# Altium schematic sheet ad2_1.schdoc
size A2
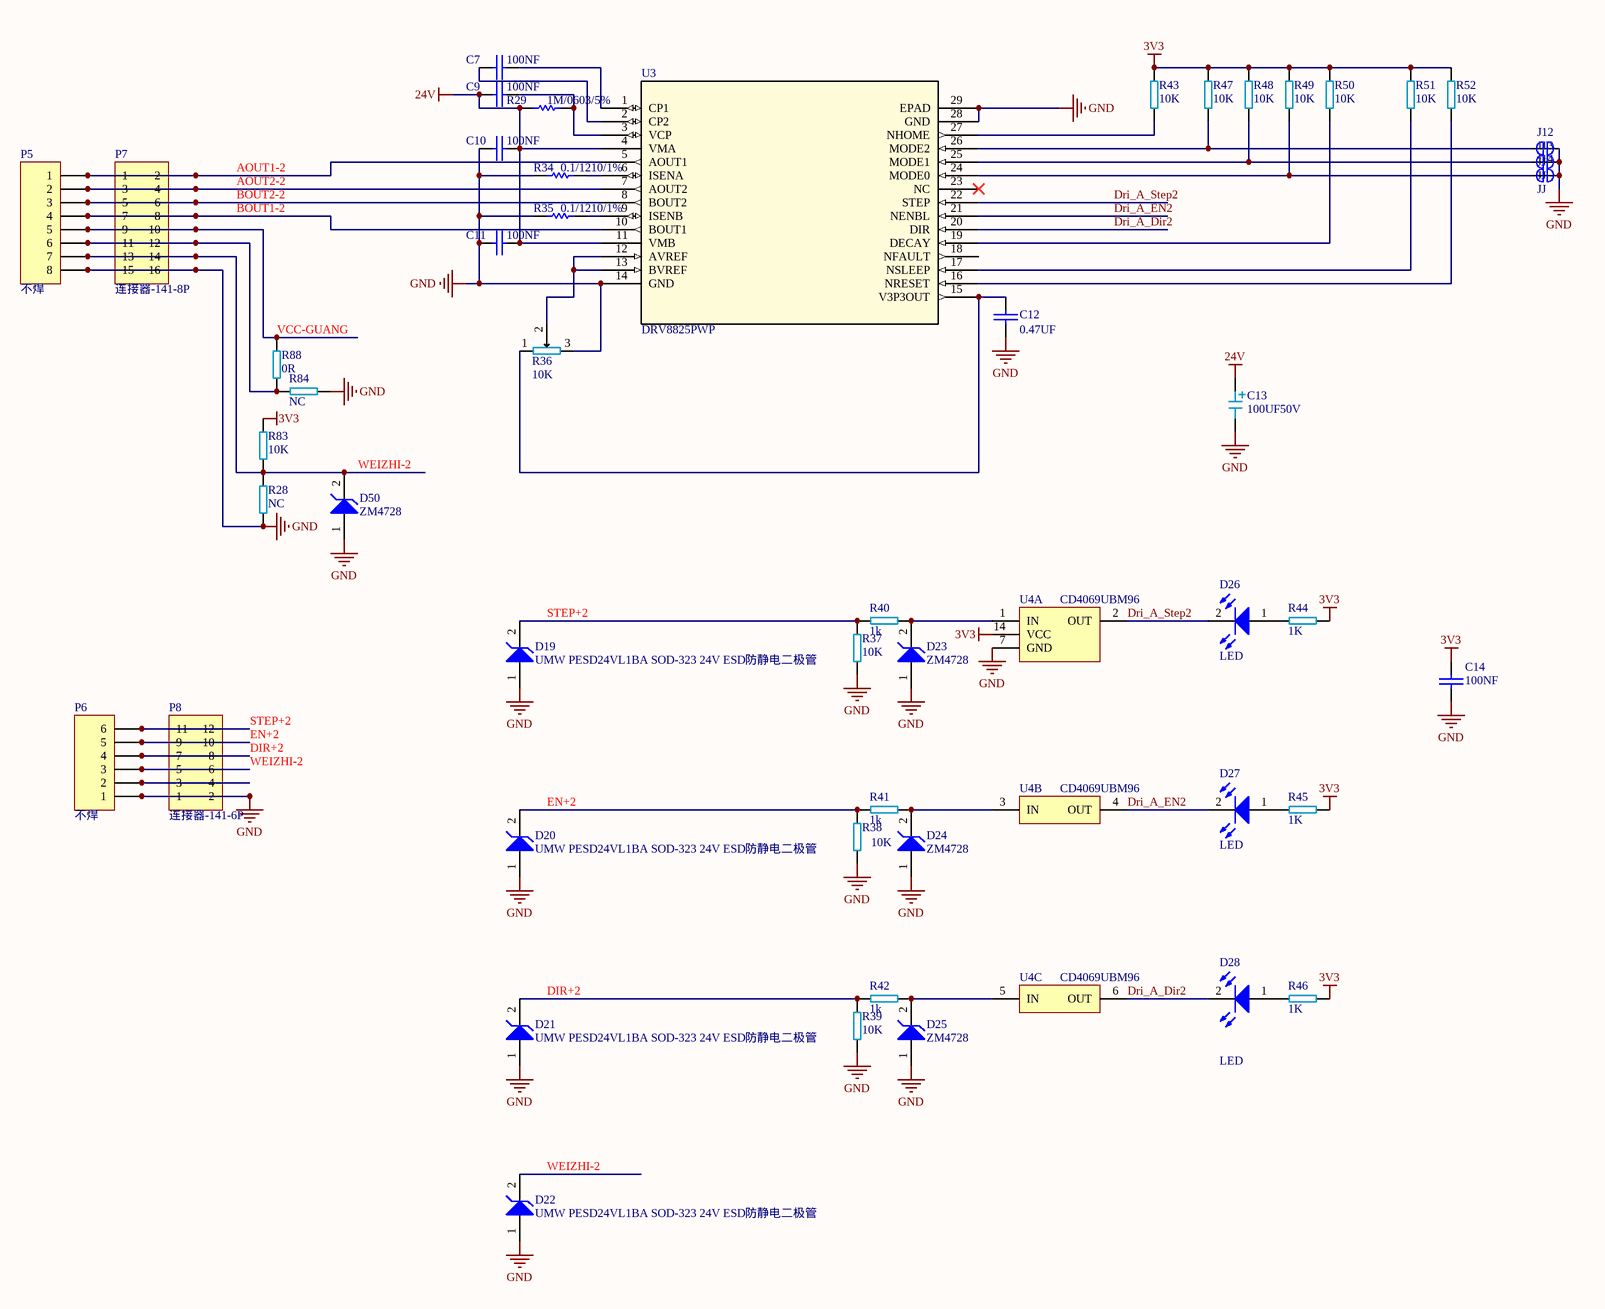
[diagram p0: ad2_1.schdoc]

## Parts
C7  100NF  [C0603]
C9  100NF  [C0603]
C10  100NF  [C0603]
C11  100NF  [C0603]
C12  0.47UF  [C0603]
C13  100UF50V  [CE8]
C14  100NF  [C0603]
D19  UMW PESD24VL1BA SOD-323 24V ESD防静电二极管  [SOD323]
D20  UMW PESD24VL1BA SOD-323 24V ESD防静电二极管  [SOD323]
D21  UMW PESD24VL1BA SOD-323 24V ESD防静电二极管  [SOD323]
D22  UMW PESD24VL1BA SOD-323 24V ESD防静电二极管  [SOD323]
D23  ZM4728  [D1206]
D24  ZM4728  [D1206]
D25  ZM4728  [D1206]
D26  LED  [LED0603]
D27  LED  [LED0603]
D28  LED  [LED0603]
D50  ZM4728  [D1206]
J12  JJ  [TIAOXIAN-PAN]
J13  JJ  [TIAOXIAN-PAN]
J14  JJ  [TIAOXIAN-PAN]
P5  不焊  [SIP8]
P6  不焊  [SIP6]
P7  连接器-141-8P  [141V-8P]
P8  连接器-141-6P  [141V-6P]
R28  NC  [R0603]
R29  1M/0603/5%  [R0603]
R34  0.1/1210/1%  [R1210]
R35  0.1/1210/1%  [R1210]
R36  10K  [RR-MINI-SMD]
R37  10K  [R0603]
R38  10K  [R0603]
R39  10K  [R0603]
R40  1k  [R0603]
R41  1k  [R0603]
R42  1k  [R0603]
R43  10K  [R0603]
R44  1K  [R0603]
R45  1K  [R0603]
R46  1K  [R0603]
R47  10K  [R0603]
R48  10K  [R0603]
R49  10K  [R0603]
R50  10K  [R0603]
R51  10K  [R0603]
R52  10K  [R0603]
R83  10K  [R0603]
R84  NC  [R0603]
R88  0R  [R0603]
U3  DRV8825PWP  [HTSSOP28]
U4  CD4069UBM96  [SO14]  (parts A,B,C of 6)

## Nets
3V3: C14.2 R43.2 R44.2 R45.2 R46.2 R47.2 R48.2 R49.2 R50.2 R51.2 R52.2 R83.2 U4.14(VCC)
24V: C9.1 C10.2 C11.2 C13.1 R29.2 U3.4(VMA) U3.11(VMB)
GND: C10.1 C11.1 C12.1 C13.2 C14.1 D19.1 D20.1 D21.1 D22.1 D23.1 D24.1 D25.1 D50.1 J12.2 J13.2 J14.2 P5.8 P6.1 P7.15 P7.16 P8.1 P8.2 R28.1 R34.2 R35.2 R36.3 R37.1 R38.1 R39.1 R84.1 U3.14(GND) U3.28(GND) U3.29(EPAD) U4.7(GND)
AOUT1-2: P5.1 P7.1 P7.2 U3.5(AOUT1)
AOUT2-2: P5.2 P7.3 P7.4 U3.7(AOUT2)
BOUT1-2: P5.4 P7.7 P7.8 U3.10(BOUT1)
BOUT2-2: P5.3 P7.5 P7.6 U3.8(BOUT2)
DIR+2: D21.2 P6.4 P8.7 P8.8 R39.2 R42.2
Dri_A_Dir2: D28.2(K) U3.20(DIR) U4.6(OUT)
Dri_A_EN2: D27.2(K) U3.21(NENBL) U4.4(OUT)
Dri_A_Step2: D26.2(K) U3.22(STEP) U4.2(OUT)
EN+2: D20.2 P6.5 P8.9 P8.10 R38.2 R41.2
STEP+2: D19.2 P6.6 P8.11 P8.12 R37.2 R40.2
VCC-GUANG: P5.5 P7.9 P7.10 R88.2
WEIZHI-2: D22.2 D50.2 P5.7 P6.3 P7.13 P7.14 P8.5 P8.6 R28.2 R83.1
NetC7_1: C7.1 U3.2(CP2)
NetC7_2: C7.2 U3.1(CP1)
NetC9_2: C9.2 R29.1 U3.3(VCP)
NetC12_2: C12.2 R36.1 U3.15(V3P3OUT)
NetD23_2: D23.2 R40.1 U4.1(IN)
NetD24_2: D24.2 R41.1 U4.3(IN)
NetD25_2: D25.2 R42.1 U4.5(IN)
NetD26_1: D26.1(A) R44.1
NetD27_1: D27.1(A) R45.1
NetD28_1: D28.1(A) R46.1
NetJ12_1: J12.1 R47.1 U3.26(MODE2)
NetJ13_1: J13.1 R48.1 U3.25(MODE1)
NetJ14_1: J14.1 R49.1 U3.24(MODE0)
NetP5_6: P5.6 P7.11 P7.12 R84.2 R88.1
NetP6_2: P6.2 P8.3 P8.4
NetR34_1: R34.1 U3.6(ISENA)
NetR35_1: R35.1 U3.9(ISENB)
NetR36_2: R36.2 U3.12(AVREF) U3.13(BVREF)
NetR43_1: R43.1 U3.27(NHOME)
NetR50_1: R50.1 U3.19(DECAY)
NetR51_1: R51.1 U3.17(NSLEEP)
NetR52_1: R52.1 U3.16(NRESET)

Not connected (* = marked no-connect by the designer): U3 18(NFAULT) 23(NC)*

## Library data of the parts
C7 C9-C12 C14 = CAP: Capacitor
C13 = C+: 铝电解电容
D19-D25 D50 = TVS-SMA: 稳压管; Published: 8-Jun-2000; LatestRevisionDate: 17-Jul-2002; LatestRevisionNote: Re-released for DXP Platform.; DatasheetVersion: 1997; PackageReference: DO-35; Publisher: Altium Limited; PackageDescription: Diode, Axial; Body 3.8 x 1.9 mm (LxDia. max), Lead Dia. 0.53 mm (max); Code_JEDEC: DO-204-AH; ComponentLink1Description: Manufacturer Link; ComponentLink1URL: http://www.fairchildsemi.com/; ComponentLink2Description: Datasheet; ComponentLink2URL: http://www.fairchildsemi.com/ds/1N%2F1N4448.pdf
D26-D28 = LED0603: Published: 8-Jun-2000; LatestRevisionDate: 08-Jul-2005; LatestRevisionNote: Mech Layer 1 removed.; PackageReference: LED-0; Publisher: Altium Limited; PackageDescription: LED; 2 Leads
J12-J14 = JJ: 跳线
P5 = SIP8: 连接器; LatestRevisionDate: 17-Jul-2002; LatestRevisionNote: Re-released for DXP Platform.; Publisher: Altium Limited
P6 = SIP6: 连接器; LatestRevisionDate: 17-Jul-2002; LatestRevisionNote: Re-released for DXP Platform.; Publisher: Altium Limited
P7 = DIC16: 连接器; LatestRevisionDate: 17-Jul-2002; LatestRevisionNote: Re-released for DXP Platform.; Publisher: Altium Limited
P8 = DIC12: 连接器; LatestRevisionDate: 17-Jul-2002; LatestRevisionNote: Re-released for DXP Platform.; Publisher: Altium Limited
R28 R37-R52 R83 R84 R88 = R-0603: 贴片电阻
R29 R34 R35 = Res1: Resistor; Value: 1K; Published: 8-Jun-2000; LatestRevisionDate: 17-Jul-2002; LatestRevisionNote: Re-released for DXP Platform.; PackageReference: AXIAL-0.3; Publisher: Altium Limited; PackageDescription: Axial Device, Thru-Hole; 2 Leads; 0.3 in Pin Spacing
R36 = RR: 电位器
U3 = DRV8825PWP: 芯片
U4 = CD4069: 芯片